# Altium schematic sheet HFD3_024-SR1_HFD3_024-SR.schdoc
size 124 x 101 mm
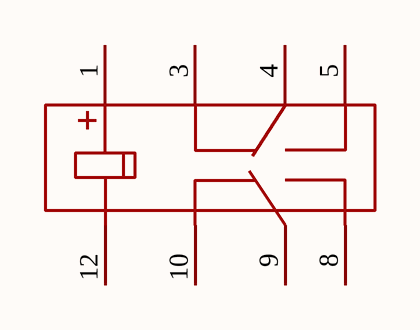
[diagram p0: HFD3_024-SR1_HFD3_024-SR.schdoc]

## Parts
K?  HFD3/024-SR  [RELAY-SMD_HF_HFD3XXX-SR]  (value not drawn)

## Nets

Not connected (* = marked no-connect by the designer): K? 1 3 4 5 8 9 10 12

## Library data of the parts
K? = HFD3/024-SR: Manufacturer: HF(宏发); Add into BOM: yes; Symbol: HFD3/024-SR; Device: HFD3/024-SR; LCSC Part Name: HFD3/024-SR; Supplier Part: C2976890; Manufacturer Part: HFD3/024-SR; Supplier Footprint: SMD,7.5x15mm; JLCPCB Part Class: Extended Part; Datasheet: https://atta.szlcsc.com/upload/public/pdf/source/20220224/5852046A7C118294A4FC4B654E452D27.pdf; Supplier: LCSC; Convert to PCB: yes